# EAGLE design Final Project (EAGLE 7.4.0)
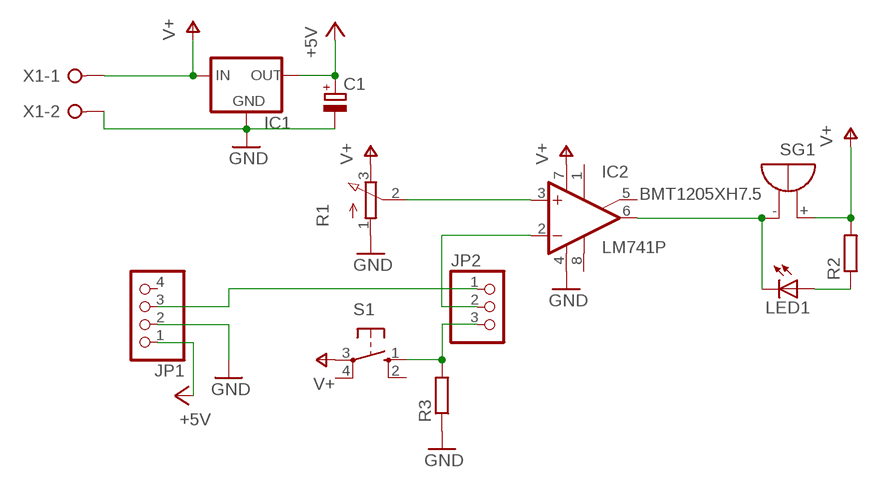
[diagram p0: schematic, sheet 1]

## Parts
C1  CPOL-EUE2.5-7  [E2,5-7]
IC1  78MXXS  [78MXXS]
IC2  LM741P  [DIL08]
JP1  PINHD-1X4  [1X04]
JP2  PINHD-1X3  [1X03]
LED1  LED5MM  [LED5MM]
R1  3RP/1610N  [3RP/1610N]
R2  R-EU_0207/7  [0207/7]
R3  R-EU_0207/7  [0207/7]
S1  10-XX  [B3F-10XX]
SG1  BMT1205XH7.5  [BMT1205XH7.5]
X1  W237-02P  [W237-132]

## Nets
+5V: C1.+ IC1.OUT JP1.1
GND: C1.- IC1.GND IC2.4(V-) JP1.2 R1.1(A) R3.1 X1.2
N$1: JP2.3 R3.2 S1.1(S)
N$2: JP1.3 JP2.1
N$3: IC2.3(+IN) R1.2(S)
N$4: IC2.6(OUT) LED1.K(C) SG1.-
N$5: LED1.A R2.1
N$6: IC2.2(-IN) JP2.2
V+: IC1.IN IC2.7(V+) R1.3(E) R2.2 S1.3(P) SG1.+ X1.1
Unconnected: IC2.1(ON1) IC2.5(ON2) IC2.8(OPT) JP1.4 S1.2(S1) S1.4(P1)

## Library data of the parts
C1 = rcl:CPOL-EU: POLARIZED CAPACITOR, European symbol
IC1 = v-reg:78MXXS: VOLTAGE REGULATOR
IC2 = linear:*741: OP AMP
JP1 = pinhead:PINHD-1X4: PIN HEADER
JP2 = pinhead:PINHD-1X3: PIN HEADER
LED1 = led:LED: LED OSRAM: - CHIPLED LG R971, LG N971, LY N971, LG Q971, LY Q971, LO R971, LY R971 LH N974, LH R974 LS Q976, LO Q976, LY Q976 LO Q996 - Hyper CHIPLED LW Q18S LB Q993, LB Q99A, LB R99A - SideLED LS A670, LO A670, LY A670, LG A670, LP A670 LB A673, LV A673, LT A673, LW A673 LH A674 LY A675 LS A676, LA A676, LO A676, LY A676, LW A676 LS A679, LY A679, LG A679 - Hyper Micro SIDELED® LS Y876, LA Y876, LO Y876, LY Y876 LT Y87S - SmartLED LW L88C, LW L88S LB L89C, LB L89S, LG L890 LS L89K, LO L89K, LY L89K LS L896, LA L896, LO L896, LY L896 - TOPLED LS T670, LO T670, LY T670, LG T670, LP T670 LSG T670, LSP T670, LSY T670, LOP T670, LYG T670 LG T671, LOG T671, LSG T671 LB T673, LV T673, LT T673, LW T673 LH T674 LS T676, LA T676, LO T676, LY T676, LB T676, LH T676, LSB T676, LW T676 LB T67C, LV T67C, LT T67C, LS T67K, LO T67K, LY T67K, LW E67C LS E67B, LA E67B, LO E67B, LY E67B, LB E67C, LV E67C, LT E67C LW T67C LS T679, LY T679, LG T679 LS T770, LO T770, LY T770, LG T770, LP T770 LB T773, LV T773, LT T773, LW T773 LH T774 LS E675, LA E675, LY E675, LS T675 LS T776, LA T776, LO T776, LY T776, LB T776 LHGB T686 LT T68C, LB T68C - Hyper Mini TOPLED® LB M676 - Mini TOPLED Santana® LG M470 LS M47K, LO M47K, LY M47K Source: http://www.osram.convergy.de LUXEON: - LUMILED® LXK2-PW12-R00, LXK2-PW12-S00, LXK2-PW14-U00, LXK2-PW14-V00 LXK2-PM12-R00, LXK2-PM12-S00, LXK2-PM14-U00 LXK2-PE12-Q00, LXK2-PE12-R00, LXK2-PE12-S00, LXK2-PE14-T00, LXK2-PE14-U00 LXK2-PB12-K00, LXK2-PB12-L00, LXK2-PB12-M00, LXK2-PB14-N00, LXK2-PB14-P00, LXK2-PB14-Q00 LXK2-PR12-L00, LXK2-PR12-M00, LXK2-PR14-Q00, LXK2-PR14-R00 LXK2-PD12-Q00, LXK2-PD12-R00, LXK2-PD12-S00 LXK2-PH12-R00, LXK2-PH12-S00 LXK2-PL12-P00, LXK2-PL12-Q00, LXK2-PL12-R00 Source: www.luxeon.com KINGBRIGHT: KA-3528ASYC Source: www.kingbright.com
R1 = pot:3RP/1610N: 16mm Potentiometer one level Source: http://www.alphapotentiometers.net/html/16mm_pot_2.html
R2 R3 = rcl:R-EU_: RESISTOR, European symbol
S1 = switch-omron:10-XX: OMRON SWITCH; MPN: B3F-1000; OC_FARNELL: 176432; OC_NEWARK: 36M3542
SG1 = buzzer:BMT1205XH7.5: MAGNETIC TRANSDUCER Source: Http:www.be-star.com; OC_FARNELL: unknown; OC_NEWARK: unknown
X1 = con-wago-508:W237-02P: WAGO SREW CLAMP; OC_FARNELL: unknown; OC_NEWARK: unknown

## Board
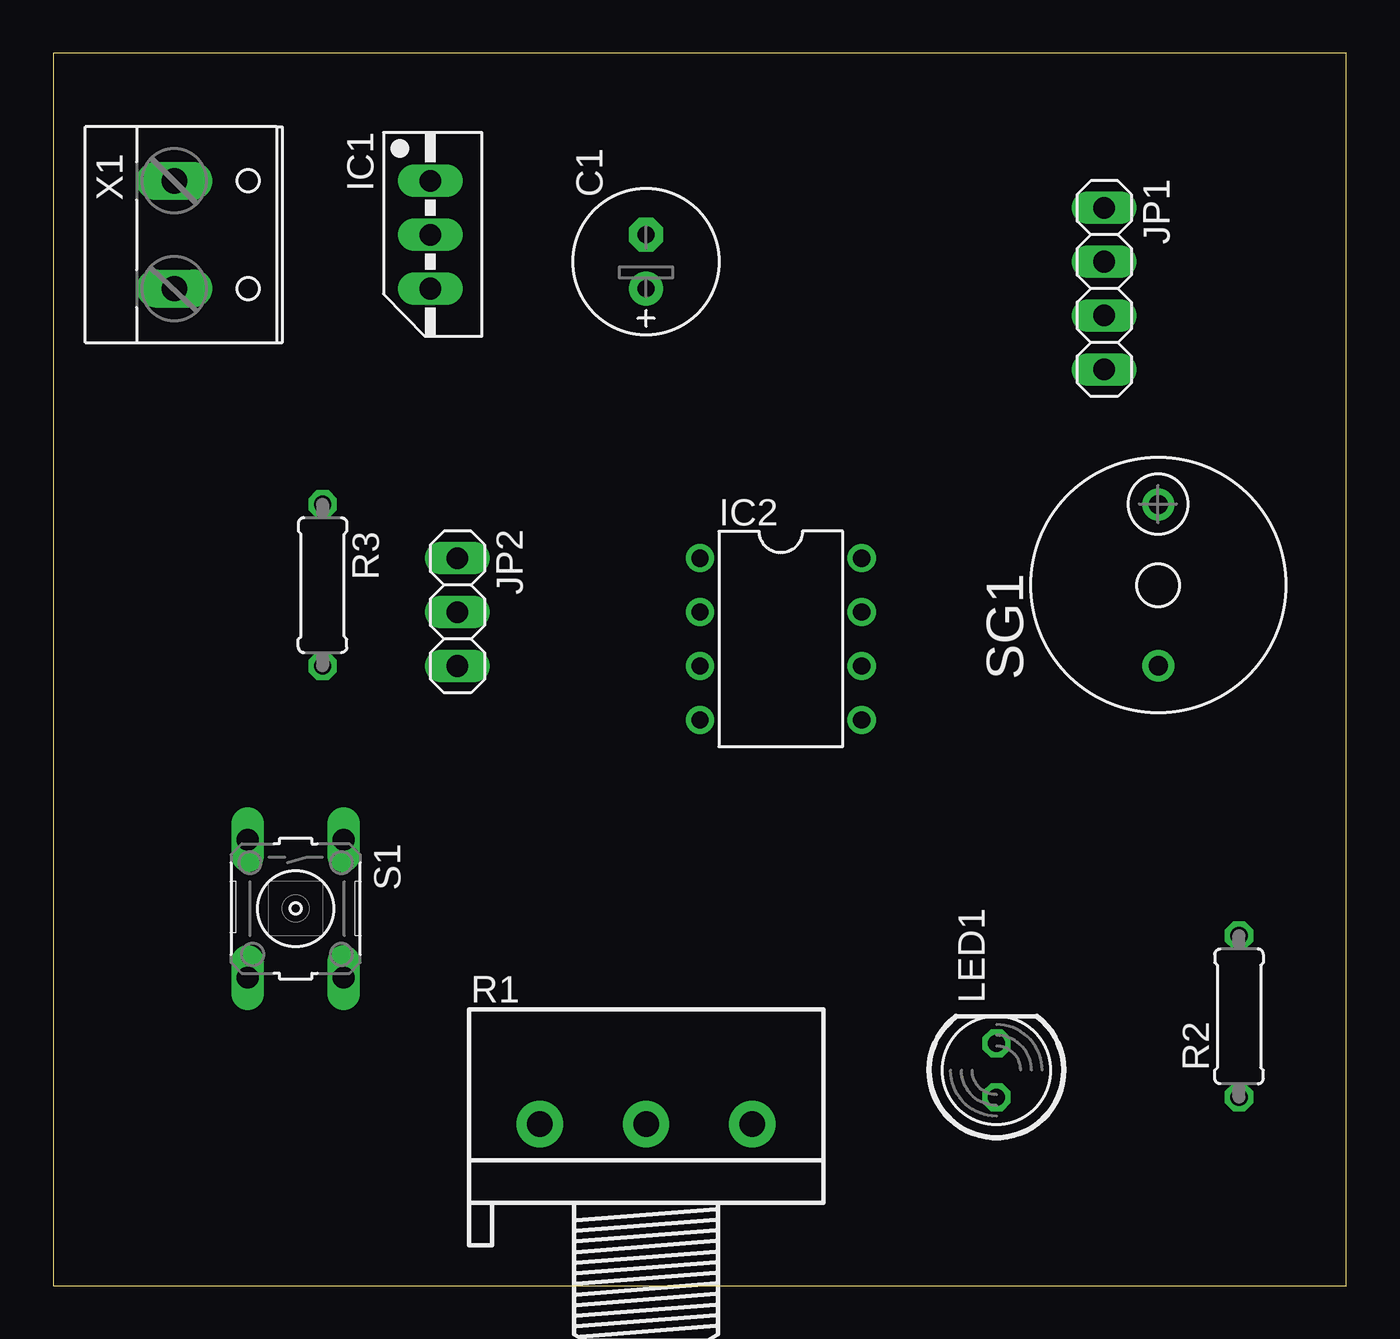
[diagram p1: board, top side]
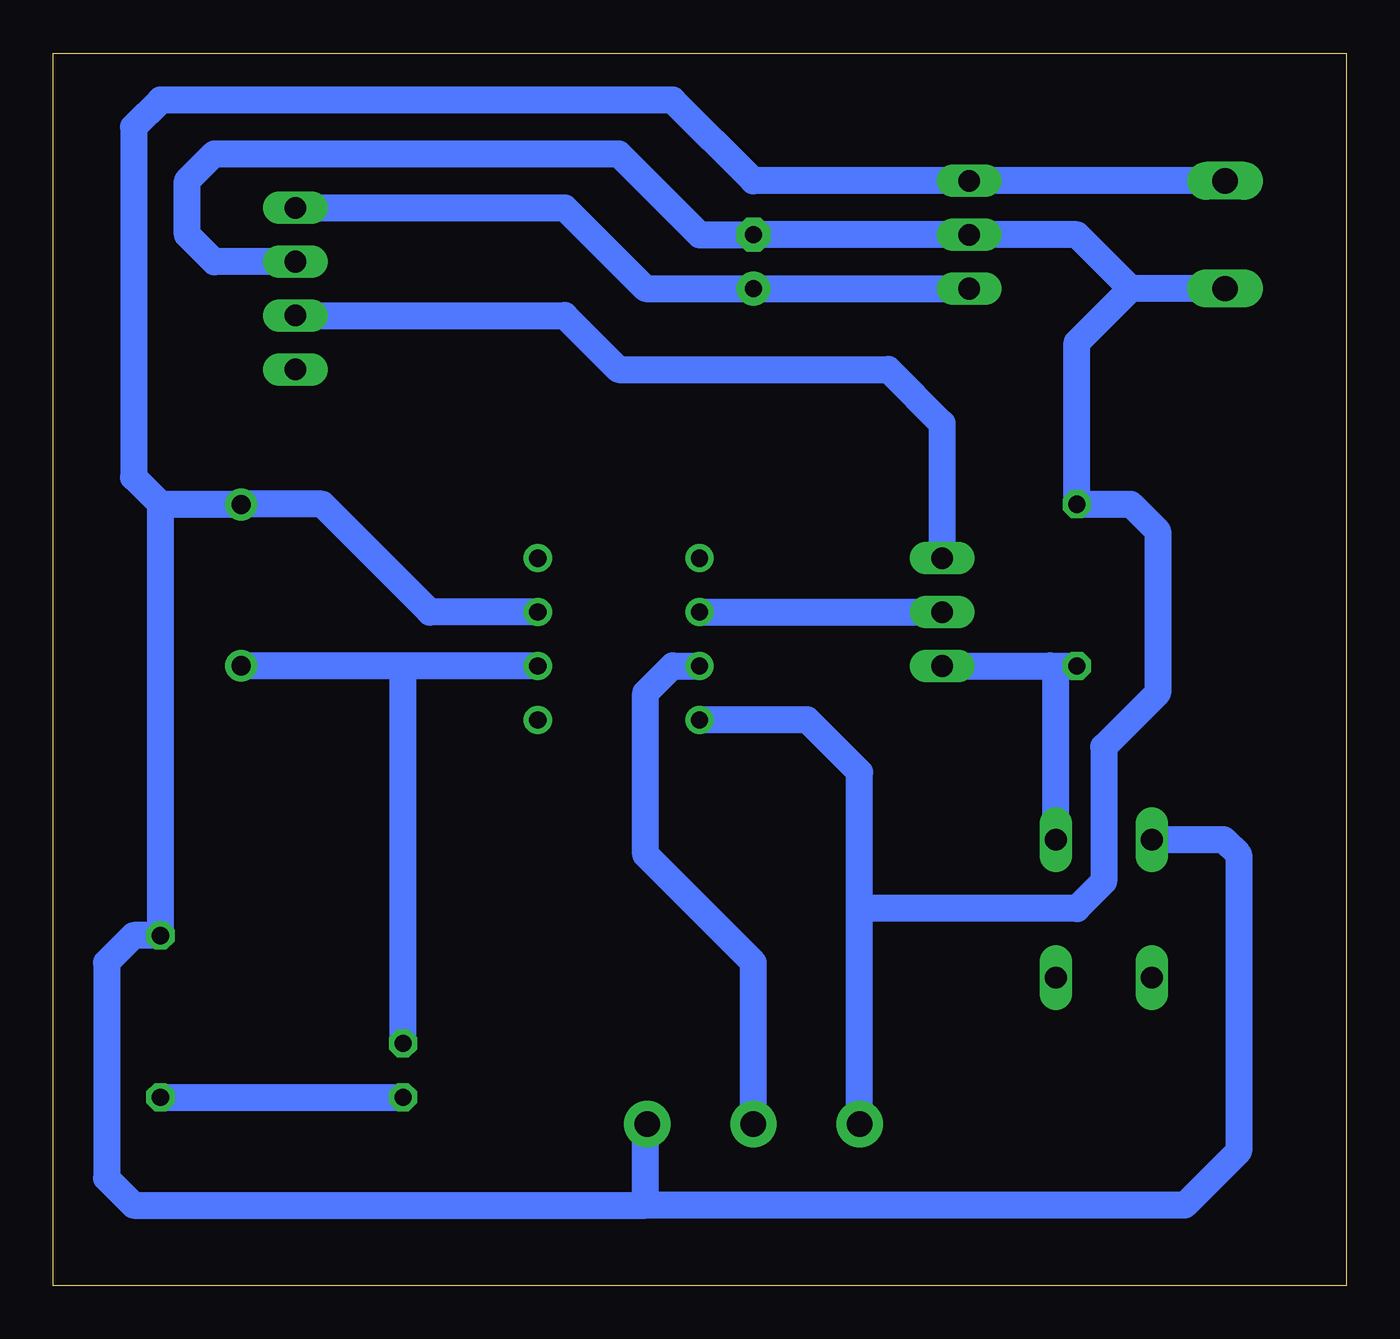
[diagram p2: board, bottom side, seen from below]

Size 60.94 x 58.09 mm. Coordinates in mm from the lower left corner, seen from the top.
Outline: 0,0 60.94,0 60.94,58.09 0,58.09 0,0
Copper layers (1*16): Top 0.035mm / dielectric 1.5mm / Bottom 0.035mm
Design rules "default": minimum track width 10mil, minimum drill 24mil, track to track 8mil, track to pad 8mil, pad to pad 8mil, via to via 8mil, smd to smd 8mil, copper to edge 40mil, drill to drill 8mil, minimum pad ring 10mil, minimum via ring 8mil, stop-mask expansion 4mil, vias tented up to drill 0mil, thermal gap 10mil

### Footprints (pad centres in the part's own frame; a part is rotated, then mirrored left to right if it is on the bottom)
E2,5-7 = drill 0.813 pad 1.6: + -1.27,0 | drill 0.813 pad 1.6 octagon: - 1.27,0
78MXXS = drill 1.016 long: GND 0,-2.54; IN -2.54,-2.54; OUT 2.54,-2.54
DIL08 = drill 0.813 pad 1.27: 1 -3.81,-3.81; 2 -1.27,-3.81; 3 1.27,-3.81; 4 3.81,-3.81; 5 3.81,3.81; 6 1.27,3.81; 7 -1.27,3.81; 8 -3.81,3.81
1X04 = drill 1.016 long: 1 -3.81,0; 2 -1.27,0; 3 1.27,0; 4 3.81,0
1X03 = drill 1.016 long: 1 -2.54,0; 2 0,0; 3 2.54,0
LED5MM = drill 0.813 octagon: A -1.27,0; K 1.27,0
3RP/1610N = drill 1.2 pad 2.184: 1 -5,0; 2 0,0; 3 5,0
0207/7 = drill 0.813 octagon: 1 -3.81,0; 2 3.81,0
B3F-10XX = drill 1.016 long: 1 -3.251,2.261; 2 3.251,2.261; 3 -3.251,-2.261; 4 3.251,-2.261
BMT1205XH7.5 = drill 0.9 pad 1.5: + 3.8,0; - -3.8,0
W237-132 = drill 1.194 long: 1 -2.54,-0.635; 2 2.54,-0.635

### Placement (x,y rotation side)
C1  27.94,48.26 90 top
IC1  20.32,49.53 270 top
IC2  34.29,30.48 270 top
JP1  49.53,46.99 270 top
JP2  19.05,31.75 270 top
LED1  44.45,10.16 90 top
R1  27.94,7.62 0 top
R2  55.88,12.7 90 top
R3  12.7,33.02 270 top
S1  11.43,17.78 270 top
SG1  52.07,33.02 90 top
X1  6.35,49.53 270 top

### Tracks (layer width: path | path; a pad name or v marks a point on that pad's centre or on a via)
+5V
  Bottom 1.27: JP1.1 36.83,50.8 33.02,46.99 C1.+ IC1.OUT
GND
  Bottom 1.27: X1.2 10.16,46.99 | 10.16,46.99 12.7,49.53 IC1.GND C1.- 30.48,49.53 34.29,53.34 53.34,53.34 54.61,52.07 54.61,49.53 53.34,48.26 JP1.2 | R1.1 22.94,17.78 | 22.94,17.78 22.94,24.21 25.4,26.67 IC2.4 | 10.16,46.99 12.7,44.45 R3.1 10.16,36.83 8.89,35.56 8.89,27.94 11.43,25.4 11.43,19.05 12.7,17.78 22.94,17.78
N$1
  Bottom 1.27: JP2.3 13.97,29.21 | 13.97,29.21 R3.2 | S1.1 13.69,28.93 13.97,29.21
N$2
  Bottom 1.27: JP1.3 36.83,45.72 34.29,43.18 21.59,43.18 19.05,40.64 JP2.1
N$3
  Bottom 1.27: R1.2 27.94,15.24 33.02,20.32 33.02,27.94 31.75,29.21 IC2.3
N$4
  Bottom 1.27: IC2.6 44.45,29.21 | 44.45,29.21 SG1.- | LED1.K 44.45,29.21
N$5
  Bottom 1.27: R2.1 LED1.A
N$6
  Bottom 1.27: IC2.2 JP2.2
V+
  Bottom 1.27: X1.1 IC1.IN 27.94,52.07 31.75,55.88 55.88,55.88 57.15,54.61 57.15,38.1 55.88,36.83 | 55.88,36.83 SG1.+ 48.26,36.83 43.18,31.75 IC2.7 | 55.88,36.83 R2.2 57.15,16.51 58.42,15.24 58.42,5.08 57.15,3.81 33.02,3.81 | 33.02,3.81 33.02,7.54 R1.3 | S1.3 5.79,21.03 5.08,20.32 5.08,6.35 7.62,3.81 33.02,3.81